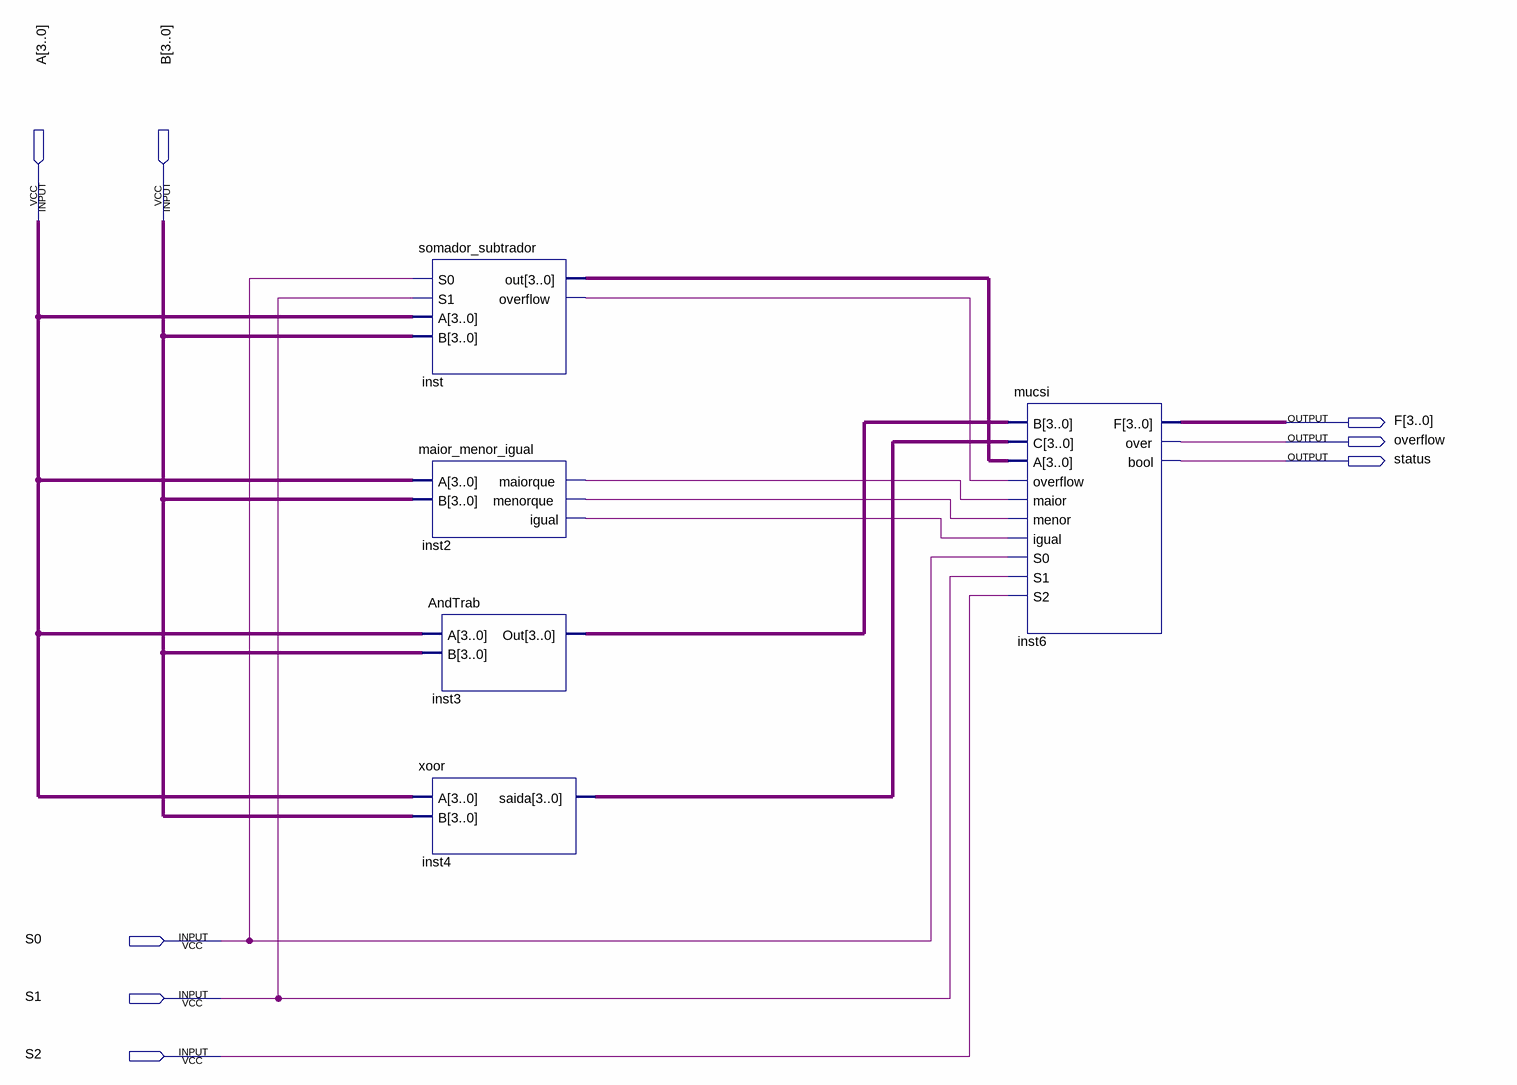
[diagram p0: schematic sheet]
// Quartus schematic ULA.bdf as structural Verilog: 5 symbols, 8 pins
module ULA (
  input  [3:0] A,
  input  [3:0] B,
  input  S0,
  input  S1,
  input  S2,
  output [3:0] F,
  output overflow,
  output status
);

  wire inst2_igual, inst2_maiorque, inst2_menorque, inst_overflow;
  wire [3:0] inst3_out, inst4_saida, inst_out;

  somador_subtrador inst (.S0(S0), .S1(S1), .A(A), .B(B), .out(inst_out), .overflow(inst_overflow));
  maior_menor_igual inst2 (.A(A), .B(B), .maiorque(inst2_maiorque), .menorque(inst2_menorque), .igual(inst2_igual));
  AndTrab inst3 (.A(A), .B(B), .Out(inst3_out));
  xoor inst4 (.A(A), .B(B), .saida(inst4_saida));
  mucsi inst6 (
    .B(inst3_out), .C(inst4_saida), .A(inst_out), .overflow(inst_overflow), .maior(inst2_maiorque),
    .menor(inst2_menorque), .igual(inst2_igual), .S0(S0), .S1(S1), .S2(S2), .F(F), .over(overflow),
    .\bool (status));
endmodule
